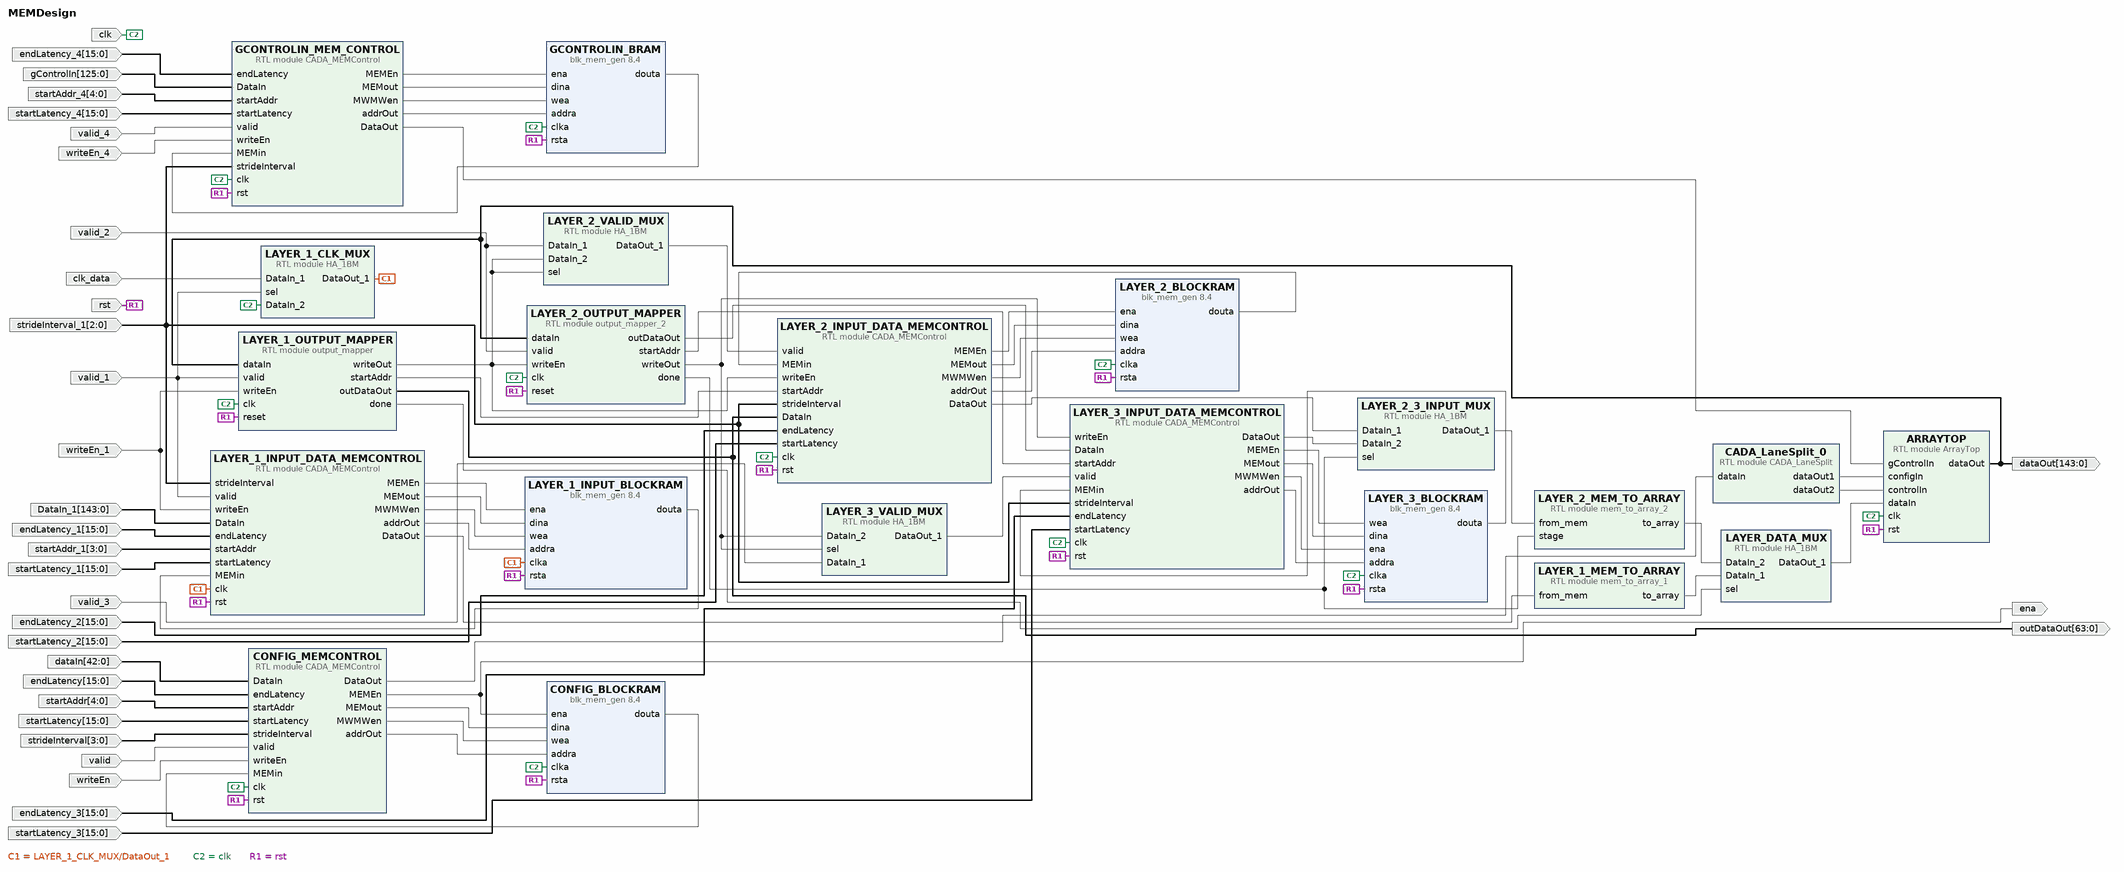
[diagram p0: block diagram of the top level]
# Vivado block design MEMDesign, xc7z020clg400-2, Vivado 2023.2
create_bd_design MEMDesign

create_bd_port -dir I clk
create_bd_port -dir I rst
create_bd_port -dir I -from 42 -to 0 dataIn
create_bd_port -dir I valid
create_bd_port -dir I writeEn
create_bd_port -dir I -from 4 -to 0 startAddr
create_bd_port -dir I -from 3 -to 0 strideInterval
create_bd_port -dir I -from 15 -to 0 startLatency
create_bd_port -dir I -from 15 -to 0 endLatency
create_bd_port -dir O ena
create_bd_port -dir I -from 125 -to 0 gControlIn
create_bd_port -dir O -from 143 -to 0 dataOut
create_bd_port -dir I valid_1
create_bd_port -dir I -from 143 -to 0 DataIn_1
create_bd_port -dir I writeEn_1
create_bd_port -dir I -from 15 -to 0 startLatency_1
create_bd_port -dir I -from 15 -to 0 endLatency_1
create_bd_port -dir I -from 3 -to 0 startAddr_1
create_bd_port -dir I -from 2 -to 0 strideInterval_1
create_bd_port -dir I clk_data
create_bd_port -dir I -from 15 -to 0 endLatency_2
create_bd_port -dir I -from 15 -to 0 startLatency_2
create_bd_port -dir I valid_2
create_bd_port -dir I valid_3
create_bd_port -dir I -from 15 -to 0 endLatency_3
create_bd_port -dir I -from 15 -to 0 startLatency_3
create_bd_port -dir I -from 15 -to 0 endLatency_4
create_bd_port -dir I -from 15 -to 0 startLatency_4
create_bd_port -dir I valid_4
create_bd_port -dir I writeEn_4
create_bd_port -dir I -from 4 -to 0 -type data startAddr_4
create_bd_port -dir O -from 63 -to 0 outDataOut

create_bd_cell -type ip -vlnv xilinx.com:ip:blk_mem_gen:8.4 CONFIG_BLOCKRAM
set_property -dict [list \
  CONFIG.Use_RSTA_Pin true \
  CONFIG.Write_Depth_A 32 \
  CONFIG.Write_Width_A 43 \
  CONFIG.use_bram_block Stand_Alone \
] [get_bd_cells CONFIG_BLOCKRAM]
create_bd_cell -type module -reference CADA_MEMControl CONFIG_MEMCONTROL
set_property -dict {CONFIG.Data_bitWidth 43} [get_bd_cells CONFIG_MEMCONTROL]
create_bd_cell -type module -reference ArrayTop ARRAYTOP
create_bd_cell -type module -reference CADA_LaneSplit CADA_LaneSplit_0
create_bd_cell -type ip -vlnv xilinx.com:ip:blk_mem_gen:8.4 LAYER_1_INPUT_BLOCKRAM
set_property -dict [list \
  CONFIG.Coe_File layer1_im2col.coe \
  CONFIG.Load_Init_File true \
  CONFIG.Use_RSTA_Pin true \
  CONFIG.Write_Depth_A 16 \
  CONFIG.Write_Width_A 144 \
  CONFIG.use_bram_block Stand_Alone \
] [get_bd_cells LAYER_1_INPUT_BLOCKRAM]
create_bd_cell -type module -reference CADA_MEMControl LAYER_1_INPUT_DATA_MEMCONTROL
set_property -dict {CONFIG.Data_bitWidth 144 CONFIG.addr_BW 4 CONFIG.stride_BW 3} [get_bd_cells LAYER_1_INPUT_DATA_MEMCONTROL]
create_bd_cell -type module -reference mem_to_array_1 LAYER_1_MEM_TO_ARRAY
create_bd_cell -type module -reference HA_1BM LAYER_1_CLK_MUX
set_property -dict {CONFIG.Mux_BW 1} [get_bd_cells LAYER_1_CLK_MUX]
create_bd_cell -type module -reference output_mapper LAYER_1_OUTPUT_MAPPER
create_bd_cell -type module -reference HA_1BM LAYER_2_VALID_MUX
set_property -dict {CONFIG.Mux_BW 1} [get_bd_cells LAYER_2_VALID_MUX]
create_bd_cell -type module -reference CADA_MEMControl LAYER_2_INPUT_DATA_MEMCONTROL
set_property -dict {CONFIG.Data_bitWidth 64 CONFIG.addr_BW 5 CONFIG.stride_BW 3} [get_bd_cells LAYER_2_INPUT_DATA_MEMCONTROL]
create_bd_cell -type ip -vlnv xilinx.com:ip:blk_mem_gen:8.4 LAYER_2_BLOCKRAM
set_property -dict [list \
  CONFIG.Load_Init_File false \
  CONFIG.Use_RSTA_Pin true \
  CONFIG.Write_Depth_A 32 \
  CONFIG.Write_Width_A 64 \
  CONFIG.use_bram_block Stand_Alone \
] [get_bd_cells LAYER_2_BLOCKRAM]
create_bd_cell -type module -reference mem_to_array_2 LAYER_2_MEM_TO_ARRAY
create_bd_cell -type module -reference HA_1BM LAYER_DATA_MUX
set_property -dict {CONFIG.Mux_BW 1728} [get_bd_cells LAYER_DATA_MUX]
create_bd_cell -type module -reference output_mapper_2 LAYER_2_OUTPUT_MAPPER
create_bd_cell -type module -reference HA_1BM LAYER_3_VALID_MUX
set_property -dict {CONFIG.Mux_BW 1} [get_bd_cells LAYER_3_VALID_MUX]
create_bd_cell -type module -reference CADA_MEMControl LAYER_3_INPUT_DATA_MEMCONTROL
set_property -dict {CONFIG.Data_bitWidth 64 CONFIG.addr_BW 5 CONFIG.stride_BW 3} [get_bd_cells LAYER_3_INPUT_DATA_MEMCONTROL]
create_bd_cell -type ip -vlnv xilinx.com:ip:blk_mem_gen:8.4 LAYER_3_BLOCKRAM
set_property -dict [list \
  CONFIG.Load_Init_File false \
  CONFIG.Use_RSTA_Pin true \
  CONFIG.Write_Depth_A 32 \
  CONFIG.Write_Width_A 64 \
  CONFIG.use_bram_block Stand_Alone \
] [get_bd_cells LAYER_3_BLOCKRAM]
create_bd_cell -type module -reference HA_1BM LAYER_2_3_INPUT_MUX
set_property -dict {CONFIG.Mux_BW 64} [get_bd_cells LAYER_2_3_INPUT_MUX]
create_bd_cell -type ip -vlnv xilinx.com:ip:blk_mem_gen:8.4 GCONTROLIN_BRAM
set_property -dict [list \
  CONFIG.Use_RSTA_Pin true \
  CONFIG.Write_Depth_A 32 \
  CONFIG.Write_Width_A 126 \
  CONFIG.use_bram_block Stand_Alone \
] [get_bd_cells GCONTROLIN_BRAM]
create_bd_cell -type module -reference CADA_MEMControl GCONTROLIN_MEM_CONTROL
set_property -dict {CONFIG.Data_bitWidth 126 CONFIG.stride_BW 3} [get_bd_cells GCONTROLIN_MEM_CONTROL]

# ---- connections ----

connect_bd_net [get_bd_pins ARRAYTOP/dataOut] \
  [get_bd_ports dataOut] [get_bd_pins LAYER_1_OUTPUT_MAPPER/dataIn] [get_bd_pins LAYER_2_OUTPUT_MAPPER/dataIn]
connect_bd_net [get_bd_pins CADA_LaneSplit_0/dataOut1] [get_bd_pins ARRAYTOP/configIn]
connect_bd_net [get_bd_pins CADA_LaneSplit_0/dataOut2] [get_bd_pins ARRAYTOP/controlIn]
connect_bd_net -net CADA_MEMControl_0_DataOut [get_bd_pins CONFIG_MEMCONTROL/DataOut] [get_bd_pins CADA_LaneSplit_0/dataIn]
connect_bd_net -net CADA_MEMControl_0_MEMEn [get_bd_pins CONFIG_MEMCONTROL/MEMEn] [get_bd_pins CONFIG_BLOCKRAM/ena] [get_bd_ports ena]
connect_bd_net -net CADA_MEMControl_0_MEMout [get_bd_pins CONFIG_MEMCONTROL/MEMout] [get_bd_pins CONFIG_BLOCKRAM/dina]
connect_bd_net -net CADA_MEMControl_0_MWMWen [get_bd_pins CONFIG_MEMCONTROL/MWMWen] [get_bd_pins CONFIG_BLOCKRAM/wea]
connect_bd_net -net CADA_MEMControl_0_addrOut [get_bd_pins CONFIG_MEMCONTROL/addrOut] [get_bd_pins CONFIG_BLOCKRAM/addra]
connect_bd_net -net CADA_MEMControl_1_DataOut [get_bd_pins LAYER_1_INPUT_DATA_MEMCONTROL/DataOut] [get_bd_pins LAYER_1_MEM_TO_ARRAY/from_mem]
connect_bd_net -net CADA_MEMControl_1_MEMEn [get_bd_pins LAYER_1_INPUT_DATA_MEMCONTROL/MEMEn] [get_bd_pins LAYER_1_INPUT_BLOCKRAM/ena]
connect_bd_net -net CADA_MEMControl_1_MEMout [get_bd_pins LAYER_1_INPUT_DATA_MEMCONTROL/MEMout] [get_bd_pins LAYER_1_INPUT_BLOCKRAM/dina]
connect_bd_net -net CADA_MEMControl_1_MWMWen [get_bd_pins LAYER_1_INPUT_DATA_MEMCONTROL/MWMWen] [get_bd_pins LAYER_1_INPUT_BLOCKRAM/wea]
connect_bd_net -net CADA_MEMControl_1_addrOut [get_bd_pins LAYER_1_INPUT_DATA_MEMCONTROL/addrOut] [get_bd_pins LAYER_1_INPUT_BLOCKRAM/addra]
connect_bd_net -net CADA_MEMControl_2_MEMEn [get_bd_pins LAYER_2_INPUT_DATA_MEMCONTROL/MEMEn] [get_bd_pins LAYER_2_BLOCKRAM/ena]
connect_bd_net -net CADA_MEMControl_2_MEMout [get_bd_pins LAYER_2_INPUT_DATA_MEMCONTROL/MEMout] [get_bd_pins LAYER_2_BLOCKRAM/dina]
connect_bd_net -net CADA_MEMControl_2_MWMWen [get_bd_pins LAYER_2_INPUT_DATA_MEMCONTROL/MWMWen] [get_bd_pins LAYER_2_BLOCKRAM/wea]
connect_bd_net -net CADA_MEMControl_2_addrOut [get_bd_pins LAYER_2_INPUT_DATA_MEMCONTROL/addrOut] [get_bd_pins LAYER_2_BLOCKRAM/addra]
connect_bd_net -net CONFIG_BLOCKRAM1_douta [get_bd_pins GCONTROLIN_BRAM/douta] [get_bd_pins GCONTROLIN_MEM_CONTROL/MEMin]
connect_bd_net -net CONFIG_MEMCONTROL1_DataOut [get_bd_pins GCONTROLIN_MEM_CONTROL/DataOut] [get_bd_pins ARRAYTOP/gControlIn]
connect_bd_net -net CONFIG_MEMCONTROL1_MEMEn [get_bd_pins GCONTROLIN_MEM_CONTROL/MEMEn] [get_bd_pins GCONTROLIN_BRAM/ena]
connect_bd_net -net CONFIG_MEMCONTROL1_MEMout [get_bd_pins GCONTROLIN_MEM_CONTROL/MEMout] [get_bd_pins GCONTROLIN_BRAM/dina]
connect_bd_net -net CONFIG_MEMCONTROL1_MWMWen [get_bd_pins GCONTROLIN_MEM_CONTROL/MWMWen] [get_bd_pins GCONTROLIN_BRAM/wea]
connect_bd_net -net CONFIG_MEMCONTROL1_addrOut [get_bd_pins GCONTROLIN_MEM_CONTROL/addrOut] [get_bd_pins GCONTROLIN_BRAM/addra]
connect_bd_net -net DataIn_1_1 [get_bd_ports DataIn_1] [get_bd_pins LAYER_1_INPUT_DATA_MEMCONTROL/DataIn]
connect_bd_net -net HA_1BM_0_DataOut_1 [get_bd_pins LAYER_1_CLK_MUX/DataOut_1] \
  [get_bd_pins LAYER_1_INPUT_BLOCKRAM/clka] [get_bd_pins LAYER_1_INPUT_DATA_MEMCONTROL/clk]
connect_bd_net -net HA_1BM_0_DataOut_2 [get_bd_pins LAYER_2_3_INPUT_MUX/DataOut_1] [get_bd_pins LAYER_2_MEM_TO_ARRAY/from_mem]
connect_bd_net -net HA_1BM_2_DataOut_1 [get_bd_pins LAYER_DATA_MUX/DataOut_1] [get_bd_pins ARRAYTOP/dataIn]
connect_bd_net [get_bd_pins LAYER_1_OUTPUT_MAPPER/done] [get_bd_pins LAYER_DATA_MUX/sel]
connect_bd_net [get_bd_pins LAYER_1_OUTPUT_MAPPER/outDataOut] [get_bd_pins LAYER_2_INPUT_DATA_MEMCONTROL/DataIn] [get_bd_ports outDataOut]
connect_bd_net [get_bd_pins LAYER_1_OUTPUT_MAPPER/startAddr] [get_bd_pins LAYER_2_INPUT_DATA_MEMCONTROL/startAddr]
connect_bd_net [get_bd_pins LAYER_1_OUTPUT_MAPPER/writeOut] \
  [get_bd_pins LAYER_2_VALID_MUX/DataIn_2] [get_bd_pins LAYER_2_VALID_MUX/sel] \
  [get_bd_pins LAYER_2_INPUT_DATA_MEMCONTROL/writeEn] [get_bd_pins LAYER_2_OUTPUT_MAPPER/writeEn]
connect_bd_net -net LAYER_2_BLOCKRAM1_douta [get_bd_pins LAYER_3_BLOCKRAM/douta] [get_bd_pins LAYER_3_INPUT_DATA_MEMCONTROL/MEMin]
connect_bd_net -net LAYER_2_INPUT_DATA_MEMCONTROL1_DataOut [get_bd_pins LAYER_3_INPUT_DATA_MEMCONTROL/DataOut] \
  [get_bd_pins LAYER_2_3_INPUT_MUX/DataIn_2]
connect_bd_net -net LAYER_2_INPUT_DATA_MEMCONTROL1_MEMEn [get_bd_pins LAYER_3_INPUT_DATA_MEMCONTROL/MEMEn] [get_bd_pins LAYER_3_BLOCKRAM/wea]
connect_bd_net -net LAYER_2_INPUT_DATA_MEMCONTROL1_MEMout [get_bd_pins LAYER_3_INPUT_DATA_MEMCONTROL/MEMout] [get_bd_pins LAYER_3_BLOCKRAM/dina]
connect_bd_net -net LAYER_2_INPUT_DATA_MEMCONTROL1_MWMWen [get_bd_pins LAYER_3_INPUT_DATA_MEMCONTROL/MWMWen] [get_bd_pins LAYER_3_BLOCKRAM/ena]
connect_bd_net -net LAYER_2_INPUT_DATA_MEMCONTROL1_addrOut [get_bd_pins LAYER_3_INPUT_DATA_MEMCONTROL/addrOut] [get_bd_pins LAYER_3_BLOCKRAM/addra]
connect_bd_net [get_bd_pins LAYER_2_INPUT_DATA_MEMCONTROL/DataOut] [get_bd_pins LAYER_2_3_INPUT_MUX/DataIn_1]
connect_bd_net [get_bd_pins LAYER_2_OUTPUT_MAPPER/outDataOut] [get_bd_pins LAYER_3_INPUT_DATA_MEMCONTROL/DataIn]
connect_bd_net -net LAYER_2_VALID_MUX1_DataOut_1 [get_bd_pins LAYER_3_VALID_MUX/DataOut_1] [get_bd_pins LAYER_3_INPUT_DATA_MEMCONTROL/valid]
connect_bd_net [get_bd_pins LAYER_2_VALID_MUX/DataOut_1] [get_bd_pins LAYER_2_INPUT_DATA_MEMCONTROL/valid]
connect_bd_net -net blk_mem_gen_0_douta [get_bd_pins CONFIG_BLOCKRAM/douta] [get_bd_pins CONFIG_MEMCONTROL/MEMin]
connect_bd_net -net blk_mem_gen_1_douta [get_bd_pins LAYER_1_INPUT_BLOCKRAM/douta] [get_bd_pins LAYER_1_INPUT_DATA_MEMCONTROL/MEMin]
connect_bd_net -net blk_mem_gen_2_douta [get_bd_pins LAYER_2_BLOCKRAM/douta] [get_bd_pins LAYER_2_INPUT_DATA_MEMCONTROL/MEMin]
connect_bd_net [get_bd_ports clk] \
  [get_bd_pins CONFIG_BLOCKRAM/clka] [get_bd_pins LAYER_2_BLOCKRAM/clka] [get_bd_pins LAYER_3_BLOCKRAM/clka] \
  [get_bd_pins GCONTROLIN_BRAM/clka] [get_bd_pins CONFIG_MEMCONTROL/clk] [get_bd_pins ARRAYTOP/clk] \
  [get_bd_pins LAYER_1_CLK_MUX/DataIn_2] [get_bd_pins LAYER_2_INPUT_DATA_MEMCONTROL/clk] \
  [get_bd_pins LAYER_3_INPUT_DATA_MEMCONTROL/clk] [get_bd_pins GCONTROLIN_MEM_CONTROL/clk] \
  [get_bd_pins LAYER_1_OUTPUT_MAPPER/clk] [get_bd_pins LAYER_2_OUTPUT_MAPPER/clk]
connect_bd_net [get_bd_ports clk_data] [get_bd_pins LAYER_1_CLK_MUX/DataIn_1]
connect_bd_net [get_bd_ports dataIn] [get_bd_pins CONFIG_MEMCONTROL/DataIn]
connect_bd_net [get_bd_ports endLatency] [get_bd_pins CONFIG_MEMCONTROL/endLatency]
connect_bd_net -net endLatency_1_1 [get_bd_ports endLatency_1] [get_bd_pins LAYER_1_INPUT_DATA_MEMCONTROL/endLatency]
connect_bd_net -net endLatency_2_1 [get_bd_ports endLatency_2] [get_bd_pins LAYER_2_INPUT_DATA_MEMCONTROL/endLatency]
connect_bd_net -net endLatency_3_1 [get_bd_ports endLatency_3] [get_bd_pins LAYER_3_INPUT_DATA_MEMCONTROL/endLatency]
connect_bd_net -net endLatency_4_1 [get_bd_ports endLatency_4] [get_bd_pins GCONTROLIN_MEM_CONTROL/endLatency]
connect_bd_net [get_bd_ports gControlIn] [get_bd_pins GCONTROLIN_MEM_CONTROL/DataIn]
connect_bd_net -net mem_to_array_1_0_to_array [get_bd_pins LAYER_1_MEM_TO_ARRAY/to_array] [get_bd_pins LAYER_DATA_MUX/DataIn_1]
connect_bd_net -net mem_to_array_2_0_to_array [get_bd_pins LAYER_2_MEM_TO_ARRAY/to_array] [get_bd_pins LAYER_DATA_MUX/DataIn_2]
connect_bd_net -net output_mapper_2_0_done [get_bd_pins LAYER_2_OUTPUT_MAPPER/done] \
  [get_bd_pins LAYER_2_3_INPUT_MUX/sel] [get_bd_pins LAYER_2_MEM_TO_ARRAY/stage]
connect_bd_net -net output_mapper_2_0_startAddr [get_bd_pins LAYER_2_OUTPUT_MAPPER/startAddr] [get_bd_pins LAYER_3_INPUT_DATA_MEMCONTROL/startAddr]
connect_bd_net -net output_mapper_2_0_writeOut [get_bd_pins LAYER_2_OUTPUT_MAPPER/writeOut] \
  [get_bd_pins LAYER_3_VALID_MUX/DataIn_2] [get_bd_pins LAYER_3_VALID_MUX/sel] \
  [get_bd_pins LAYER_3_INPUT_DATA_MEMCONTROL/writeEn]
connect_bd_net [get_bd_ports rst] \
  [get_bd_pins CONFIG_BLOCKRAM/rsta] [get_bd_pins LAYER_1_INPUT_BLOCKRAM/rsta] [get_bd_pins LAYER_2_BLOCKRAM/rsta] \
  [get_bd_pins LAYER_3_BLOCKRAM/rsta] [get_bd_pins GCONTROLIN_BRAM/rsta] [get_bd_pins CONFIG_MEMCONTROL/rst] \
  [get_bd_pins ARRAYTOP/rst] [get_bd_pins LAYER_1_INPUT_DATA_MEMCONTROL/rst] [get_bd_pins LAYER_2_INPUT_DATA_MEMCONTROL/rst] \
  [get_bd_pins LAYER_3_INPUT_DATA_MEMCONTROL/rst] [get_bd_pins GCONTROLIN_MEM_CONTROL/rst] \
  [get_bd_pins LAYER_1_OUTPUT_MAPPER/reset] [get_bd_pins LAYER_2_OUTPUT_MAPPER/reset]
connect_bd_net [get_bd_ports startAddr] [get_bd_pins CONFIG_MEMCONTROL/startAddr]
connect_bd_net -net startAddr_1_1 [get_bd_ports startAddr_1] [get_bd_pins LAYER_1_INPUT_DATA_MEMCONTROL/startAddr]
connect_bd_net -net startAddr_4_1 [get_bd_ports startAddr_4] [get_bd_pins GCONTROLIN_MEM_CONTROL/startAddr]
connect_bd_net [get_bd_ports startLatency] [get_bd_pins CONFIG_MEMCONTROL/startLatency]
connect_bd_net -net startLatency_1_1 [get_bd_ports startLatency_1] [get_bd_pins LAYER_1_INPUT_DATA_MEMCONTROL/startLatency]
connect_bd_net -net startLatency_2_1 [get_bd_ports startLatency_2] [get_bd_pins LAYER_2_INPUT_DATA_MEMCONTROL/startLatency]
connect_bd_net -net startLatency_3_1 [get_bd_ports startLatency_3] [get_bd_pins LAYER_3_INPUT_DATA_MEMCONTROL/startLatency]
connect_bd_net -net startLatency_4_1 [get_bd_ports startLatency_4] [get_bd_pins GCONTROLIN_MEM_CONTROL/startLatency]
connect_bd_net -net strideInterval_1_1 [get_bd_ports strideInterval_1] \
  [get_bd_pins LAYER_1_INPUT_DATA_MEMCONTROL/strideInterval] [get_bd_pins LAYER_2_INPUT_DATA_MEMCONTROL/strideInterval] \
  [get_bd_pins LAYER_3_INPUT_DATA_MEMCONTROL/strideInterval] [get_bd_pins GCONTROLIN_MEM_CONTROL/strideInterval]
connect_bd_net [get_bd_ports strideInterval] [get_bd_pins CONFIG_MEMCONTROL/strideInterval]
connect_bd_net [get_bd_ports valid] [get_bd_pins CONFIG_MEMCONTROL/valid]
connect_bd_net -net valid_1_1 [get_bd_ports valid_1] \
  [get_bd_pins LAYER_1_INPUT_DATA_MEMCONTROL/valid] [get_bd_pins LAYER_1_CLK_MUX/sel] \
  [get_bd_pins LAYER_1_OUTPUT_MAPPER/valid]
connect_bd_net -net valid_2_1 [get_bd_ports valid_2] [get_bd_pins LAYER_2_VALID_MUX/DataIn_1] [get_bd_pins LAYER_2_OUTPUT_MAPPER/valid]
connect_bd_net -net valid_3_1 [get_bd_ports valid_3] [get_bd_pins LAYER_3_VALID_MUX/DataIn_1]
connect_bd_net -net valid_4_1 [get_bd_ports valid_4] [get_bd_pins GCONTROLIN_MEM_CONTROL/valid]
connect_bd_net [get_bd_ports writeEn] [get_bd_pins CONFIG_MEMCONTROL/writeEn]
connect_bd_net -net writeEn_1_1 [get_bd_ports writeEn_1] \
  [get_bd_pins LAYER_1_INPUT_DATA_MEMCONTROL/writeEn] [get_bd_pins LAYER_1_OUTPUT_MAPPER/writeEn]
connect_bd_net -net writeEn_4_1 [get_bd_ports writeEn_4] [get_bd_pins GCONTROLIN_MEM_CONTROL/writeEn]

validate_bd_design
save_bd_design
